# Altium project simple.PrjPcb
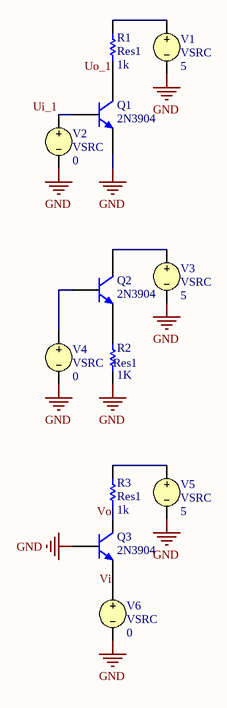
[diagram p0: Sheet1.SchDoc]
1 sheet, 12 parts. Net scope: global (net labels, ports and power ports of the same name join across sheets).

## Sheet Sheet1.SchDoc
size A4; SheetNumber: 1; SheetTotal: 1

### Parts
Q1  2N3904  [TO-92A]
Q2  2N3904  [TO-92A]
Q3  2N3904  [TO-92A]
R1  Res1  value 1k  [AXIAL-0.3]
R2  Res1  value 1K  [AXIAL-0.3]
R3  Res1  value 1k  [AXIAL-0.3]
V1  VSRC  value 5
V2  VSRC  DC Magnitude: 0
V3  VSRC  value 5
V4  VSRC  DC Magnitude: 0
V5  VSRC  value 5
V6  VSRC  DC Magnitude: 0

### Nets
GND: Q1.1(E) Q3.2(B) R2.1 V1.2 V2.2 V3.2 V4.2 V5.2 V6.2
Ui_1: Q1.2(B) V2.1
Uo_1: Q1.3(C) R1.1
Vi: Q3.1(E) V6.1
Vo: Q3.3(C) R3.1
NetQ2_1: Q2.1(E) R2.2
NetQ2_2: Q2.2(B) V4.1
NetQ2_3: Q2.3(C) V3.1
NetR1_2: R1.2 V1.1
NetR3_2: R3.2 V5.1

### Library data of the parts
Q1-Q3 = 2N3904: NPN General Purpose Amplifier; Published: 8-Jun-2000; LatestRevisionDate: 15-Jan-2003; LatestRevisionNote: PCB Footprint 'BCY-W3/D4.7' replaced; DatasheetVersion: 1997; PackageVersion: Sep-1998; PackageReference: TO-92A; Publisher: Altium Limited; PackageDescription: TO, Flat Index; 3 In-Line, Axial Leads; Body Dia. 4.5mm; Leads 0.51 x 0.48 mm (max); ComponentLink1Description: Manufacturer Link; ComponentLink1URL: http://www.fairchildsemi.com/; ComponentLink2Description: Datasheet; ComponentLink2URL: http://www.fairchildsemi.com/ds/2N%2F2N3904.pdf
R1-R3 = Res1: Resistor; Published: 8-Jun-2000; LatestRevisionDate: 17-Jul-2002; LatestRevisionNote: Re-released for DXP Platform.; PackageReference: AXIAL-0.3; Publisher: Altium Limited; PackageDescription: Axial Device, Thru-Hole; 2 Leads; 0.3 in Pin Spacing
V1 = VSRC: Voltage Source; Note: PCB Footprint - Not required; AC Magnitude: 0; Published: 30-July-2020; LatestRevisionDate: 30-July-2020; LatestRevisionNote: Re-released for DXP Platform.; PackageReference: Not Applicable; Publisher: Altium Limited; AC Phase: 0
V2 V4 V6 = VSRC: Voltage Source; Note: PCB Footprint - Not required; Amplitude: 0.7; Frequency: 100; Published: 30-July-2020; LatestRevisionDate: 30-July-2020; LatestRevisionNote: Re-released for DXP Platform.; PackageReference: Not Applicable; Publisher: Altium Limited; AC Magnitude: 0; AC Phase: 0; Offset: 0; Delay: 0; Damping Factor: 0; Phase: 0
V3 V5 = VSRC: Voltage Source; Note: PCB Footprint - Not required; AC Magnitude: 1; AC Phase: 0; Published: 30-July-2020; LatestRevisionDate: 30-July-2020; LatestRevisionNote: Re-released for DXP Platform.; PackageReference: Not Applicable; Publisher: Altium Limited